# Altium schematic sheet bolid-inputs-lv.SchDoc
size A3
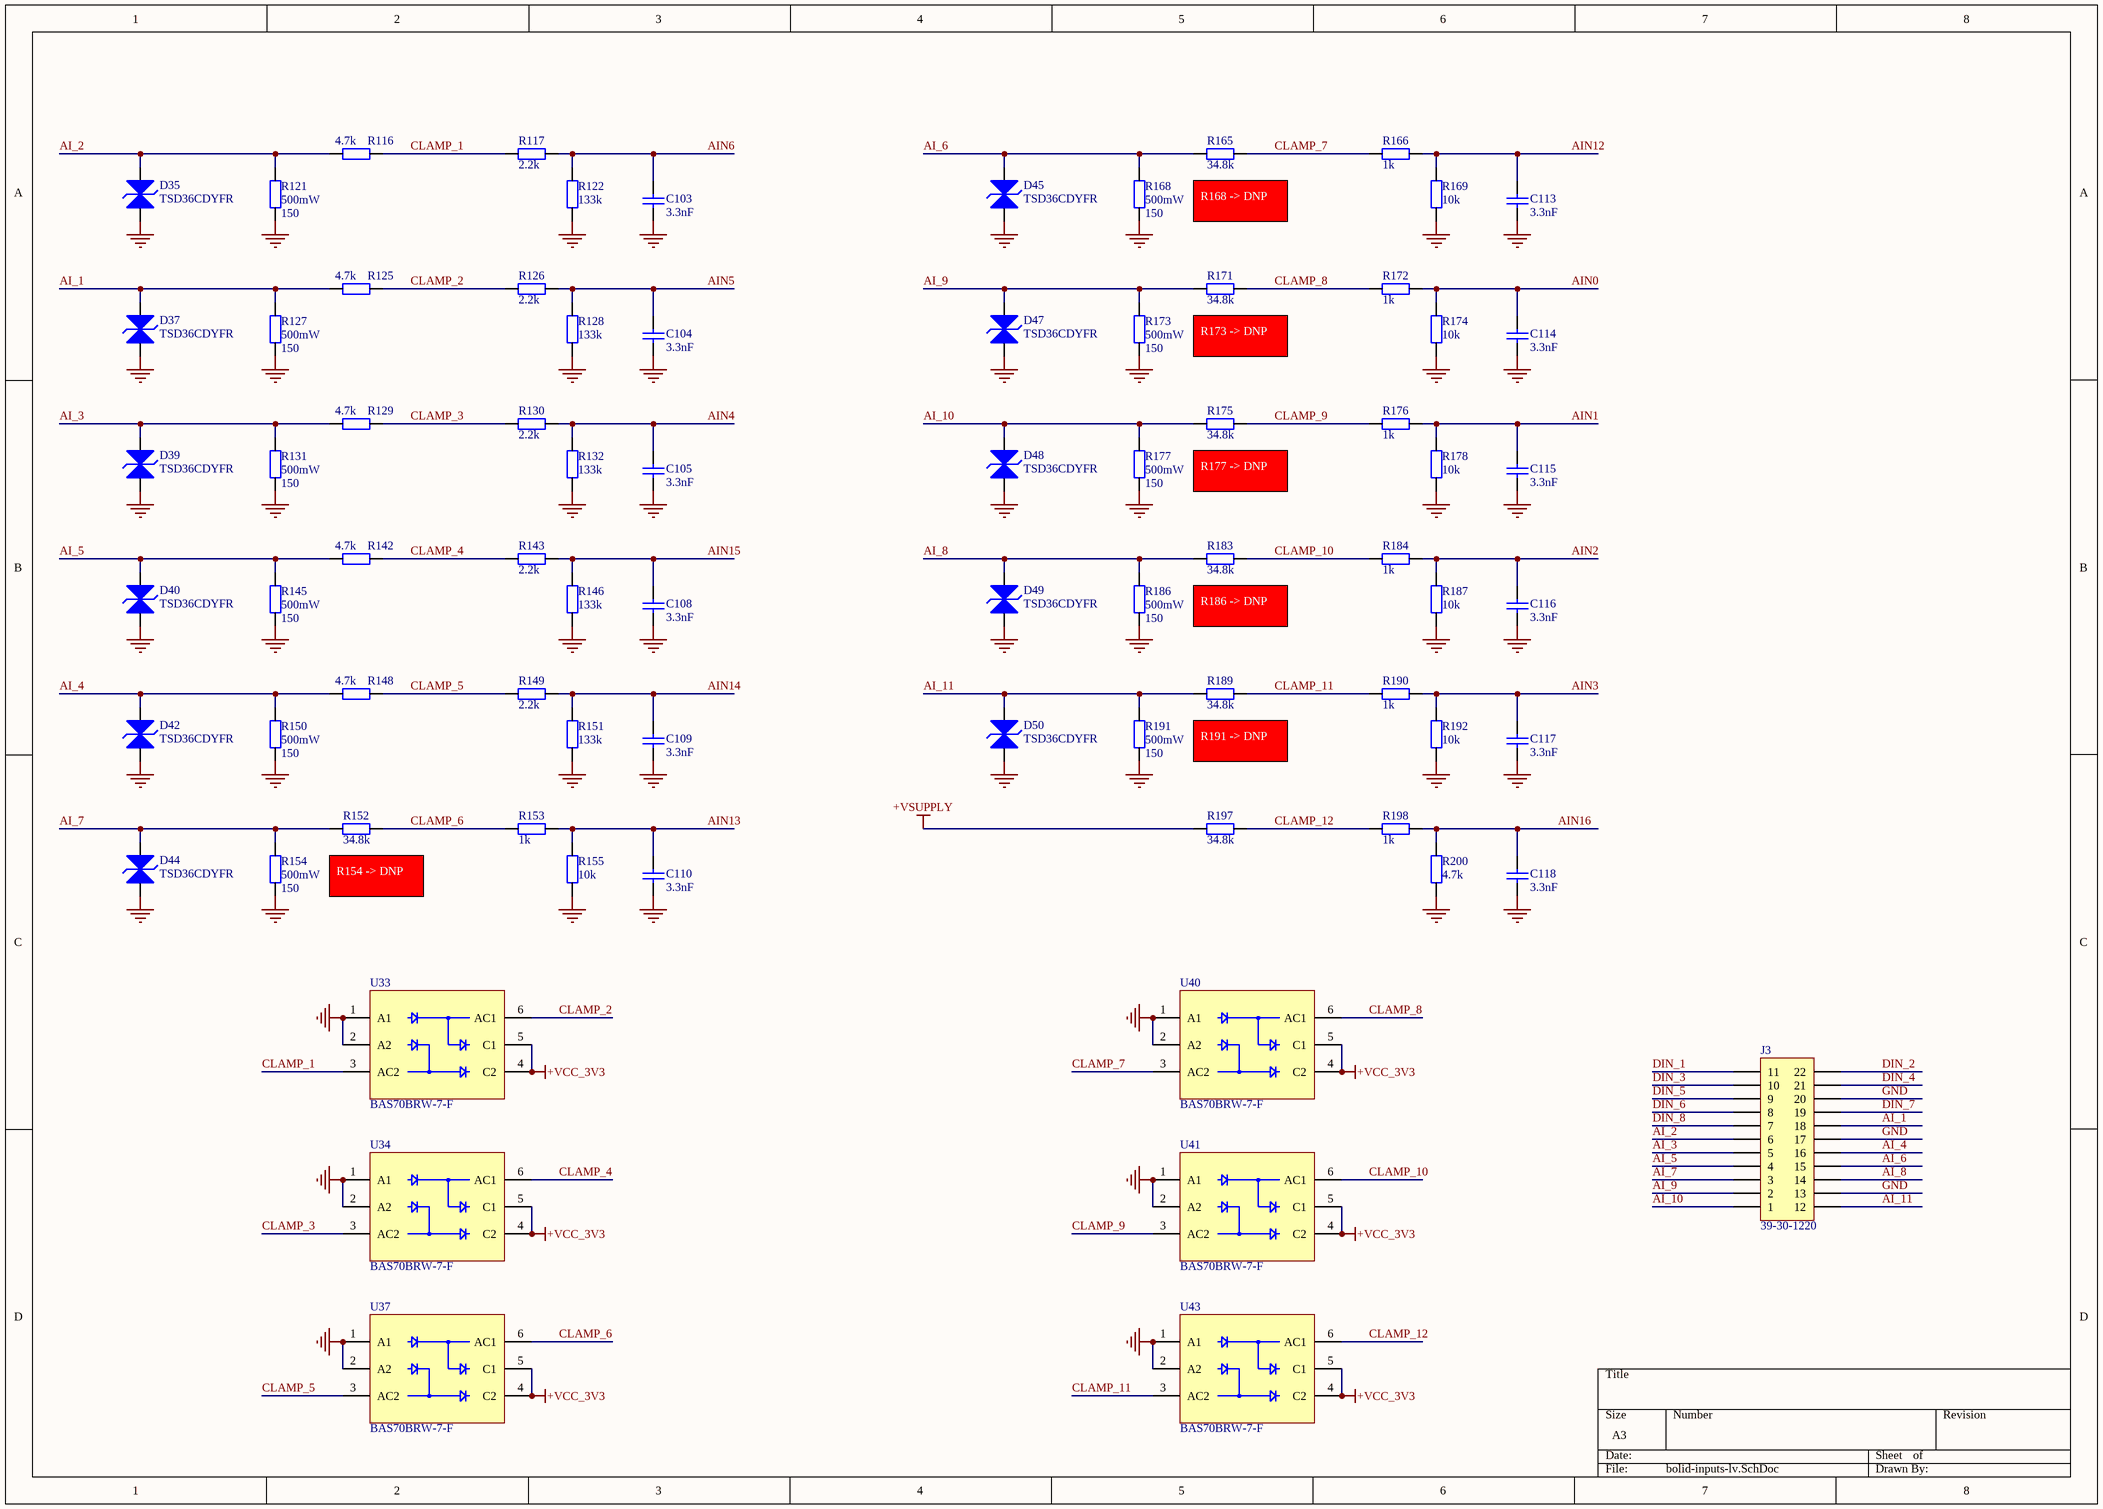
[diagram p0: bolid-inputs-lv.SchDoc]

## Parts
C103  Value Displayed: 3.3nF  [C0402-CAPC100X50X55L22 - Tayio Yuden TDK]  (hidden comment: GRM155R71H332JA01J)
C104  Value Displayed: 3.3nF  [C0402-CAPC100X50X55L22 - Tayio Yuden TDK]  (hidden comment: GRM155R71H332JA01J)
C105  Value Displayed: 3.3nF  [C0402-CAPC100X50X55L22 - Tayio Yuden TDK]  (hidden comment: GRM155R71H332JA01J)
C108  Value Displayed: 3.3nF  [C0402-CAPC100X50X55L22 - Tayio Yuden TDK]  (hidden comment: GRM155R71H332JA01J)
C109  Value Displayed: 3.3nF  [C0402-CAPC100X50X55L22 - Tayio Yuden TDK]  (hidden comment: GRM155R71H332JA01J)
C110  Value Displayed: 3.3nF  [C0402-CAPC100X50X55L22 - Tayio Yuden TDK]  (hidden comment: GRM155R71H332JA01J)
C113  Value Displayed: 3.3nF  [C0402-CAPC100X50X55L22 - Tayio Yuden TDK]  (hidden comment: GRM155R71H332JA01J)
C114  Value Displayed: 3.3nF  [C0402-CAPC100X50X55L22 - Tayio Yuden TDK]  (hidden comment: GRM155R71H332JA01J)
C115  Value Displayed: 3.3nF  [C0402-CAPC100X50X55L22 - Tayio Yuden TDK]  (hidden comment: GRM155R71H332JA01J)
C116  Value Displayed: 3.3nF  [C0402-CAPC100X50X55L22 - Tayio Yuden TDK]  (hidden comment: GRM155R71H332JA01J)
C117  Value Displayed: 3.3nF  [C0402-CAPC100X50X55L22 - Tayio Yuden TDK]  (hidden comment: GRM155R71H332JA01J)
C118  Value Displayed: 3.3nF  [C0402-CAPC100X50X55L22 - Tayio Yuden TDK]  (hidden comment: GRM155R71H332JA01J)
D35  TSD36CDYFR  [SOD-323 DYF0002A TI - BIDIRECTIONAL]
D37  TSD36CDYFR  [SOD-323 DYF0002A TI - BIDIRECTIONAL]
D39  TSD36CDYFR  [SOD-323 DYF0002A TI - BIDIRECTIONAL]
D40  TSD36CDYFR  [SOD-323 DYF0002A TI - BIDIRECTIONAL]
D42  TSD36CDYFR  [SOD-323 DYF0002A TI - BIDIRECTIONAL]
D44  TSD36CDYFR  [SOD-323 DYF0002A TI - BIDIRECTIONAL]
D45  TSD36CDYFR  [SOD-323 DYF0002A TI - BIDIRECTIONAL]
D47  TSD36CDYFR  [SOD-323 DYF0002A TI - BIDIRECTIONAL]
D48  TSD36CDYFR  [SOD-323 DYF0002A TI - BIDIRECTIONAL]
D49  TSD36CDYFR  [SOD-323 DYF0002A TI - BIDIRECTIONAL]
D50  TSD36CDYFR  [SOD-323 DYF0002A TI - BIDIRECTIONAL]
J3  39-30-1220  [MOLEX Mini-Fit Jr 039301220 2x11 Peg]
R116  value 4.7k  [R0402-RESC100X50X40L22N]  (hidden comment: RC0402FR-074K7L)
R117  value 2.2k  [R0402-RESC100X50X40L22N]  (hidden comment: RC0402FR-072K2L)
R121  value 150  Power Rating: 500mW  [R1210-RESC3126X06N - Yageo]  (hidden comment: RC1210FR-07150RL)
R122  value 133k  [R0402-RESC100X50X40L22N]  (hidden comment: RC0402FR-07133KL)
R125  value 4.7k  [R0402-RESC100X50X40L22N]  (hidden comment: RC0402FR-074K7L)
R126  value 2.2k  [R0402-RESC100X50X40L22N]  (hidden comment: RC0402FR-072K2L)
R127  value 150  Power Rating: 500mW  [R1210-RESC3126X06N - Yageo]  (hidden comment: RC1210FR-07150RL)
R128  value 133k  [R0402-RESC100X50X40L22N]  (hidden comment: RC0402FR-07133KL)
R129  value 4.7k  [R0402-RESC100X50X40L22N]  (hidden comment: RC0402FR-074K7L)
R130  value 2.2k  [R0402-RESC100X50X40L22N]  (hidden comment: RC0402FR-072K2L)
R131  value 150  Power Rating: 500mW  [R1210-RESC3126X06N - Yageo]  (hidden comment: RC1210FR-07150RL)
R132  value 133k  [R0402-RESC100X50X40L22N]  (hidden comment: RC0402FR-07133KL)
R142  value 4.7k  [R0402-RESC100X50X40L22N]  (hidden comment: RC0402FR-074K7L)
R143  value 2.2k  [R0402-RESC100X50X40L22N]  (hidden comment: RC0402FR-072K2L)
R145  value 150  Power Rating: 500mW  [R1210-RESC3126X06N - Yageo]  (hidden comment: RC1210FR-07150RL)
R146  value 133k  [R0402-RESC100X50X40L22N]  (hidden comment: RC0402FR-07133KL)
R148  value 4.7k  [R0402-RESC100X50X40L22N]  (hidden comment: RC0402FR-074K7L)
R149  value 2.2k  [R0402-RESC100X50X40L22N]  (hidden comment: RC0402FR-072K2L)
R150  value 150  Power Rating: 500mW  [R1210-RESC3126X06N - Yageo]  (hidden comment: RC1210FR-07150RL)
R151  value 133k  [R0402-RESC100X50X40L22N]  (hidden comment: RC0402FR-07133KL)
R152  value 34.8k  [R0402-RESC100X50X40L22N]  (hidden comment: RC0402FR-0734K8L)
R153  value 1k  [R0402-RESC100X50X40L22N]  (hidden comment: RC0402FR-071KL)
R154  value 150  Power Rating: 500mW  [R1210-RESC3126X06N - Yageo]  (hidden comment: RC1210FR-07150RL)
R155  value 10k  [R0402-RESC100X50X40L22N]  (hidden comment: RC0402FR-0710KL)
R165  value 34.8k  [R0402-RESC100X50X40L22N]  (hidden comment: RC0402FR-0734K8L)
R166  value 1k  [R0402-RESC100X50X40L22N]  (hidden comment: RC0402FR-071KL)
R168  value 150  Power Rating: 500mW  [R1210-RESC3126X06N - Yageo]  (hidden comment: RC1210FR-07150RL)
R169  value 10k  [R0402-RESC100X50X40L22N]  (hidden comment: RC0402FR-0710KL)
R171  value 34.8k  [R0402-RESC100X50X40L22N]  (hidden comment: RC0402FR-0734K8L)
R172  value 1k  [R0402-RESC100X50X40L22N]  (hidden comment: RC0402FR-071KL)
R173  value 150  Power Rating: 500mW  [R1210-RESC3126X06N - Yageo]  (hidden comment: RC1210FR-07150RL)
R174  value 10k  [R0402-RESC100X50X40L22N]  (hidden comment: RC0402FR-0710KL)
R175  value 34.8k  [R0402-RESC100X50X40L22N]  (hidden comment: RC0402FR-0734K8L)
R176  value 1k  [R0402-RESC100X50X40L22N]  (hidden comment: RC0402FR-071KL)
R177  value 150  Power Rating: 500mW  [R1210-RESC3126X06N - Yageo]  (hidden comment: RC1210FR-07150RL)
R178  value 10k  [R0402-RESC100X50X40L22N]  (hidden comment: RC0402FR-0710KL)
R183  value 34.8k  [R0402-RESC100X50X40L22N]  (hidden comment: RC0402FR-0734K8L)
R184  value 1k  [R0402-RESC100X50X40L22N]  (hidden comment: RC0402FR-071KL)
R186  value 150  Power Rating: 500mW  [R1210-RESC3126X06N - Yageo]  (hidden comment: RC1210FR-07150RL)
R187  value 10k  [R0402-RESC100X50X40L22N]  (hidden comment: RC0402FR-0710KL)
R189  value 34.8k  [R0402-RESC100X50X40L22N]  (hidden comment: RC0402FR-0734K8L)
R190  value 1k  [R0402-RESC100X50X40L22N]  (hidden comment: RC0402FR-071KL)
R191  value 150  Power Rating: 500mW  [R1210-RESC3126X06N - Yageo]  (hidden comment: RC1210FR-07150RL)
R192  value 10k  [R0402-RESC100X50X40L22N]  (hidden comment: RC0402FR-0710KL)
R197  value 34.8k  [R0402-RESC100X50X40L22N]  (hidden comment: RC0402FR-0734K8L)
R198  value 1k  [R0402-RESC100X50X40L22N]  (hidden comment: RC0402FR-071KL)
R200  value 4.7k  [R0402-RESC100X50X40L22N]  (hidden comment: RC0402FR-074K7L)
U33  BAS70BRW-7-F  [SOT363 DIODES DS30158 Rev. 14-2 SOT65P210X110-6N]
U34  BAS70BRW-7-F  [SOT363 DIODES DS30158 Rev. 14-2 SOT65P210X110-6N]
U37  BAS70BRW-7-F  [SOT363 DIODES DS30158 Rev. 14-2 SOT65P210X110-6N]
U40  BAS70BRW-7-F  [SOT363 DIODES DS30158 Rev. 14-2 SOT65P210X110-6N]
U41  BAS70BRW-7-F  [SOT363 DIODES DS30158 Rev. 14-2 SOT65P210X110-6N]
U43  BAS70BRW-7-F  [SOT363 DIODES DS30158 Rev. 14-2 SOT65P210X110-6N]

## Nets
+VCC_3V3: U33.4(C2) U33.5(C1) U34.4(C2) U34.5(C1) U37.4(C2) U37.5(C1) U40.4(C2) U40.5(C1) U41.4(C2) U41.5(C1) U43.4(C2) U43.5(C1)
+VSUPPLY: R197.1
GND: C103.1 C104.1 C105.1 C108.1 C109.1 C110.1 C113.1 C114.1 C115.1 C116.1 C117.1 C118.1 D35.1 D37.1 D39.1 D40.1 D42.1 D44.1 D45.1 D47.1 D48.1 D49.1 D50.1 J3.13 J3.17 J3.20 R121.1 R122.1 R127.1 R128.1 R131.1 R132.1 R145.1 R146.1 R150.1 R151.1 R154.1 R155.1 R168.1 R169.1 R173.1 R174.1 R177.1 R178.1 R186.1 R187.1 R191.1 R192.1 R200.1 U33.1(A1) U33.2(A2) U34.1(A1) U34.2(A2) U37.1(A1) U37.2(A2) U40.1(A1) U40.2(A2) U41.1(A1) U41.2(A2) U43.1(A1) U43.2(A2)
AI_1: D37.2 J3.18 R125.1 R127.2
AI_2: D35.2 J3.6 R116.1 R121.2
AI_3: D39.2 J3.5 R129.1 R131.2
AI_4: D42.2 J3.16 R148.1 R150.2
AI_5: D40.2 J3.4 R142.1 R145.2
AI_6: D45.2 J3.15 R165.1 R168.2
AI_7: D44.2 J3.3 R152.1 R154.2
AI_8: D49.2 J3.14 R183.1 R186.2
AI_9: D47.2 J3.2 R171.1 R173.2
AI_10: D48.2 J3.1 R175.1 R177.2
AI_11: D50.2 J3.12 R189.1 R191.2
AIN0: C114.2 R172.2 R174.2
AIN1: C115.2 R176.2 R178.2
AIN2: C116.2 R184.2 R187.2
AIN3: C117.2 R190.2 R192.2
AIN4: C105.2 R130.1 R132.2
AIN5: C104.2 R126.1 R128.2
AIN6: C103.2 R117.1 R122.2
AIN12: C113.2 R166.2 R169.2
AIN13: C110.2 R153.2 R155.2
AIN14: C109.2 R149.1 R151.2
AIN15: C108.2 R143.1 R146.2
AIN16: C118.2 R198.2 R200.2
CLAMP_1: R116.2 R117.2 U33.3(AC2)
CLAMP_2: R125.2 R126.2 U33.6(AC1)
CLAMP_3: R129.2 R130.2 U34.3(AC2)
CLAMP_4: R142.2 R143.2 U34.6(AC1)
CLAMP_5: R148.2 R149.2 U37.3(AC2)
CLAMP_6: R152.2 R153.1 U37.6(AC1)
CLAMP_7: R165.2 R166.1 U40.3(AC2)
CLAMP_8: R171.2 R172.1 U40.6(AC1)
CLAMP_9: R175.2 R176.1 U41.3(AC2)
CLAMP_10: R183.2 R184.1 U41.6(AC1)
CLAMP_11: R189.2 R190.1 U43.3(AC2)
CLAMP_12: R197.2 R198.1 U43.6(AC1)
DIN_1: J3.11
DIN_2: J3.22
DIN_3: J3.10
DIN_4: J3.21
DIN_5: J3.9
DIN_6: J3.8
DIN_7: J3.19
DIN_8: J3.7

## Notes on the sheet
- (near R165) R168 -> DNP
- (near R171) R173 -> DNP
- (near R175) R177 -> DNP
- (near R183) R186 -> DNP
- (near R189) R191 -> DNP
- (near R152) R154 -> DNP

## Library data of the parts
C103-C105 C108-C110 C113-C118 = GRM155R71H332JA01J: MLCC 0402 (1005) 3.3nF 5% 50V X7R; Manufacturer: Murata; Value: 3.3n; Supplier 1: Mouser; Manufacturer Part Number: GRM155R71H332JA01J; RoHS: Yes; Category: Ceramic Capacitors; Stock 1: 49279; Pricing 1: 1=0,1, 10=0,022, 50=0,022, 100=0,011, 1000=0,007, 10000=0,006 (USD); Case/Package: 343Case; Voltage Rating (DC): 50V; Dielectric: X7R; Tolerance: 5%; Capacitance: 3.3nF; Length: 1mm; Width: 500um; Thickness: 500um; RoHS Compliant: Yes; Supplier Part Number 1: 81-GRM155R71H332JA1J
D35 D37 D39 D40 D42 D44 D45 D47-D50 = TSD36CDYFR: 36V bidirectional surge protection diode in SOD323 package 2-SOT -55 to 150; Manufacturer: Texas Instruments; Supplier 1: Mouser; Manufacturer Part Number: TSD36CDYFR; RoHS: No; Stock 1: 6000; Pricing 1: 1=0,4, 10=0,29, 50=0,29, 100=0,146, 1000=0,1, 10000=0,078 (USD); Case/Package: SOT; Number of Pins: 2; Length: 1.3mm; Width: 1.7mm; Thickness: 850um; Supplier Part Number 1: 595-TSD36CDYFR
J3 = 039301220: Molex MiniFit Jr 2x11 Peg Conn Power HDR 22 POS 4.2mm Solder RA Thru-Hole 22 Terminal 1 Port Bag; Supplier 1: Mouser; Manufacturer: Molex; Manufacturer Part Number: 39-30-1220; RoHS: Yes; Category: Headers and Wire Housings; Stock 1: 554; Pricing 1: 1=3,28, 10=2,69, 50=2,69, 100=2,29, 1000=2,16, 10000=2,15 (USD); ComponentLink1URL: https://datasheet.ciiva.com/5149/0039301220-pcb-headers-160144-5149966.pdf?src-supplier=Mouser; ComponentLink1Description: https://datasheet.ciiva.com/5149/0039301220-pcb-headers-160144-5149966.pdf?src-supplier=Mouser; ComponentLink2URL: https://datasheet.ciiva.com/11750/0900766b805f2c40-11750460.pdf?src-supplier=Rs; ComponentLink2Description: https://datasheet.ciiva.com/11750/0900766b805f2c40-11750460.pdf?src-supplier=Rs; ComponentLink3URL: https://datasheet.ciiva.com/1443/1775068-1443200.pdf?src-supplier=Element14; ComponentLink3Description: https://datasheet.ciiva.com/1443/1775068-1443200.pdf?src-supplier=Element14; ComponentLink4URL: https://datasheet.ciiva.com/30171/97700039301220-pcb-headers-30171274.pdf?src-supplier=Onlinecomponents.com; ComponentLink4Description: https://datasheet.ciiva.com/30171/97700039301220-pcb-headers-30171274.pdf?src-supplier=Onlinecomponents.com; ComponentLink5URL: https://datasheet.ciiva.com/49273/304186-49273820.pdf?src-supplier=Jameco; ComponentLink5Description: https://datasheet.ciiva.com/49273/304186-49273820.pdf?src-supplier=Jameco; ComponentLink6URL: https://datasheet.ciiva.com/1451/1775068-1451585.pdf?src-supplier=Farnell; ComponentLink6Description: https://datasheet.ciiva.com/1451/1775068-1451585.pdf?src-supplier=Farnell; Supplier Part Number 1: 538-39-30-1220
R116 R125 R129 R142 R148 R200 = RC0402FR-074K7L: RES 0402 (1005) 4.70k 1% 0.063W 50V Thick Film; Manufacturer: Yageo; Power Rating: 62.5 mW (1/16 W); Resistance: 4.7 kOhms; Temperature Coefficient: 100 PPM / C; Supplier 1: Mouser; Manufacturer Part Number: RC0402FR-074K7L; RoHS: RoHS Compliant By Exemption; Category: Thick Film Resistors - SMD; Stock 1: 1586127; Pricing 1: 1=0.090, 10=0.011, 100=0.004, 1000=0.003, 10000=0.003 (EUR); Application: High Reliability; Features: -; Height: 0.35 mm; Length: 1 mm; Package / Case: -; Packaging: Cut Tape; Product: Thick Film Resistors SMD; Series: RC; Technology: Thick Film; Termination Style: SMD/SMT; Tolerance: 1 %; Type: General Purpose; Voltage Rating: 50 V; Width: 0.5 mm; Brand: Yageo; Mounting Style: PCB Mount; Case Code - in: 0402; Case Code - mm: 1005; Maximum Operating Temperature: + 155 C; Minimum Operating Temperature: - 55 C; Product Type: Thick Film Resistors; Standard Pack Qty: 10000; Subcategory: Resistors; RoHS - Mouser: E; Minimum Order Quantity: 1; Reeling: True; ComponentLink1URL: https://www.mouser.com/datasheet/2/447/PYu-RC_Group_51_RoHS_L_10-1664068.pdf; ComponentLink1Description: https://www.mouser.com/datasheet/2/447/PYu-RC_Group_51_RoHS_L_10-1664068.pdf; Supplier Part Number 1: 603-RC0402FR-074K7L
R117 R126 R130 R143 R149 = RC0402FR-072K2L: RES 0402 (1005) 2.20k 1% 0.0625W 50V Thick Film; Manufacturer: Yageo; Power Rating: 62.5 mW, 125 mW; Resistance: 2.2 kOhms; Temperature Coefficient: 100 PPM / C; Supplier 1: Mouser; Manufacturer Part Number: RC0402FR-072K2L; RoHS: RoHS Compliant By Exemption; Category: Thick Film Resistors - SMD; Stock 1: 1394386; Pricing 1: 1=0.090, 10=0.011, 100=0.004, 1000=0.003, 10000=0.003 (EUR); Application: High Reliability; Features: -; Height: 0.35 mm; Length: 1 mm; Package / Case: -; Packaging: Cut Tape; Product: Thick Film Resistors SMD; Series: RC; Technology: Thick Film; Termination Style: SMD/SMT; Tolerance: 1 %; Type: General Purpose; Voltage Rating: 50 V; Width: 0.5 mm; Brand: Yageo; Mounting Style: PCB Mount; Case Code - in: 0402; Case Code - mm: 1005; Maximum Operating Temperature: + 155 C; Minimum Operating Temperature: - 55 C; Product Type: Thick Film Resistors; Standard Pack Qty: 10000; Subcategory: Resistors; RoHS - Mouser: E; Minimum Order Quantity: 1; Reeling: True; ComponentLink1URL: https://www.mouser.com/datasheet/2/447/PYu-RC_Group_51_RoHS_L_10-1664068.pdf; ComponentLink1Description: https://www.mouser.com/datasheet/2/447/PYu-RC_Group_51_RoHS_L_10-1664068.pdf; Supplier Part Number 1: 603-RC0402FR-072K2L
R121 R127 R131 R145 R150 R154 R168 R173 R177 R186 R191 = RC1210FR-07150RL: RES 1210 (3225) 150.0R 1% 0.500W 200V Thick Film; Manufacturer: Yageo; Resistance: 150R; Temperature Coefficient: 100ppm/°C; Supplier 1: Mouser; Manufacturer Part Number: RC1210FR-07150RL; RoHS: Yes; Category: Chip SMD Resistors; Stock 1: 69300; Pricing 1: 1=0,12, 10=0,035, 50=0,035, 100=0,022, 1000=0,015, 10000=0,014 (USD); Mount: Surface Mount; Case/Package: 1210; Case Code (Imperial): 1210; Case Code (Metric): 3225; Contact Plating: Tin,Matte; Min Operating Temperature: -55°C; Max Operating Temperature: 155°C; Packaging: Tape and Reel; Tolerance: 1%; Voltage Rating: 200V; Termination: SMD/SMT; Number of Terminations: 2; Max Power Dissipation: 500mW; Features: Moisture Resistant; Series: RC; Technology: THICK FILM; Length: 3.1mm; Width: 2.6mm; Height: 0.5mm; Depth: 2.6mm; RoHS Compliant: Yes; ComponentLink1URL: https://datasheet.ciiva.com/11809/0900766b8079c86c-11809577.pdf?src-supplier=Rs; ComponentLink1Description: https://datasheet.ciiva.com/11809/0900766b8079c86c-11809577.pdf?src-supplier=Rs; ComponentLink2URL: https://datasheet.ciiva.com/8887/pyu-rc1210-51-rohs-l-4-8887352.pdf?src-supplier=Avnet; ComponentLink2Description: https://datasheet.ciiva.com/8887/pyu-rc1210-51-rohs-l-4-8887352.pdf?src-supplier=Avnet; Supplier Part Number 1: 603-RC1210FR-07150RL
R122 R128 R132 R146 R151 = RC0402FR-07133KL: RES 0402 (1005) 133.0k 1% 0.0625W 50V Thick Film; Manufacturer: Yageo; Resistance: 133kR; Power Rating: 62.5mW; Temperature Coefficient: 100ppm/°C; Max Power Dissipation: 63mW; Supplier 1: Mouser; Manufacturer Part Number: RC0402FR-07133KL; RoHS: Yes; Category: Chip SMD Resistors; Stock 1: 76079; Pricing 1: 1=0,10000, 10=0,01200, 50=0,01200, 100=0,00500, 1000=0,00300, 2500=0,00200, 10000=0,00100 (USD); Case/Package: 0402; Case Code (Imperial): 0402; Case Code (Metric): 1005; Weight: 2.3E-05oz; Contact Plating: Tin,Matte; Min Operating Temperature: -55°C; Max Operating Temperature: 155°C; Tolerance: 1%; Voltage Rating: 50V; Packaging: Tape and Reel; Resistor Type: Thick Film; Termination: SMD/SMT; Number of Terminations: 2; Voltage Rating (DC): 50V; Working Voltage: 50V; Features: Moisture Resistant; Series: RC; Construction: Rectangular; Technology: THICK FILM; Length: 1mm; Width: 0.5mm; Height: 0.016inch; Depth: 0.5mm; Military Standard: Not; Lead Free: Lead Free; RoHS Compliant: Yes; ComponentLink1URL: https://datasheet.ciiva.com/8887/pyu-rc0402-51-rohs-l-6-8887454.pdf?src-supplier=Avnet; ComponentLink1Description: https://datasheet.ciiva.com/8887/pyu-rc0402-51-rohs-l-6-8887454.pdf?src-supplier=Avnet; ComponentLink2URL: https://datasheet.ciiva.com/16742/pyu-rc0402-51-rohs-l-6-r-16742778.pdf?src-supplier=Future+Electronics; ComponentLink2Description: https://datasheet.ciiva.com/16742/pyu-rc0402-51-rohs-l-6-r-16742778.pdf?src-supplier=Future+Electronics; Supplier Part Number 1: 603-RC0402FR-07133KL
R152 R165 R171 R175 R183 R189 R197 = RC0402FR-0734K8L: RES 0402 (1005) 34.8k 1% 0.0625W 50V Thick Film; Manufacturer: Yageo; Power Rating: 62.5 mW (1/16 W); Resistance: 34.8 kOhms; Temperature Coefficient: 100 PPM / C; Supplier 1: Mouser; Manufacturer Part Number: RC0402FR-0734K8L; RoHS: RoHS Compliant By Exemption; Category: Thick Film Resistors - SMD; Stock 1: 26065; Pricing 1: 1=0.085, 10=0.010, 100=0.003, 10000=0.003 (EUR); Application: High Reliability; Features: -; Height: 0.35 mm; Length: 1 mm; Package / Case: -; Packaging: Cut Tape; Product: Thick Film Resistors SMD; Series: RC; Technology: Thick Film; Termination Style: SMD/SMT; Tolerance: 1 %; Type: General Purpose; Voltage Rating: 50 V; Width: 0.5 mm; Brand: Yageo; Mounting Style: PCB Mount; Case Code - in: 0402; Case Code - mm: 1005; Maximum Operating Temperature: + 155 C; Minimum Operating Temperature: - 55 C; Product Type: Thick Film Resistors; Standard Pack Qty: 10000; Subcategory: Resistors; RoHS - Mouser: E; Minimum Order Quantity: 1; Reeling: True; ComponentLink1URL: https://www.mouser.com/datasheet/2/447/PYu_RC_Group_51_RoHS_L_10-1664068.pdf; ComponentLink1Description: https://www.mouser.com/datasheet/2/447/PYu_RC_Group_51_RoHS_L_10-1664068.pdf; Supplier Part Number 1: 603-RC0402FR-0734K8L
R153 R166 R172 R176 R184 R190 R198 = RC0402FR-071KL: RES 0402 (1005) 1.00k 1% 0.0625W 50V Thick Film; Manufacturer: Yageo; Power Rating: 62.5 mW, 125 mW; Resistance: 1 kOhms; Temperature Coefficient: 100 PPM / C; Supplier 1: Mouser; Manufacturer Part Number: RC0402FR-071KL; RoHS: RoHS Compliant; Category: Thick Film Resistors - SMD; Stock 1: 18776448; Pricing 1: 1=0.090, 10=0.011, 100=0.004, 1000=0.003, 10000=0.003 (EUR); Application: High Reliability; Features: -; Height: 0.35 mm; Length: 1 mm; Package / Case: -; Packaging: Cut Tape; Product: Thick Film Resistors SMD; Series: RC; Technology: Thick Film; Termination Style: SMD/SMT; Tolerance: 1 %; Type: General Purpose; Voltage Rating: 50 V; Width: 0.5 mm; Brand: Yageo; Mounting Style: PCB Mount; Case Code - in: 0402; Case Code - mm: 1005; Maximum Operating Temperature: + 155 C; Minimum Operating Temperature: - 55 C; Product Type: Thick Film Resistors; Standard Pack Qty: 10000; Subcategory: Resistors; RoHS - Mouser: Y; Minimum Order Quantity: 1; Reeling: True; ComponentLink1URL: https://www.mouser.com/datasheet/2/447/PYu-RC_Group_51_RoHS_L_10-1664068.pdf; ComponentLink1Description: https://www.mouser.com/datasheet/2/447/PYu-RC_Group_51_RoHS_L_10-1664068.pdf; Supplier Part Number 1: 603-RC0402FR-071KL
R155 R169 R174 R178 R187 R192 = RC0402FR-0710KL: RES 0402 (1005) 10.0k 1% 0.0625W 50V Thick Film; Manufacturer: Yageo; Power Rating: 62.5 mW, 125 mW; Resistance: 10 kOhms; Temperature Coefficient: 100 PPM / C; Supplier 1: Mouser; Manufacturer Part Number: RC0402FR-0710KL; RoHS: RoHS Compliant; Category: Thick Film Resistors - SMD; Stock 1: 20942447; Pricing 1: 1=0.090, 10=0.011, 100=0.004, 1000=0.003, 10000=0.003 (EUR); Application: High Reliability; Features: -; Height: 0.35 mm; Length: 1 mm; Package / Case: -; Packaging: Cut Tape; Product: Thick Film Resistors SMD; Series: RC; Technology: Thick Film; Termination Style: SMD/SMT; Tolerance: 1 %; Type: General Purpose; Voltage Rating: 50 V; Width: 0.5 mm; Brand: Yageo; Mounting Style: PCB Mount; Case Code - in: 0402; Case Code - mm: 1005; Maximum Operating Temperature: + 155 C; Minimum Operating Temperature: - 55 C; Product Type: Thick Film Resistors; Standard Pack Qty: 10000; Subcategory: Resistors; RoHS - Mouser: Y; Minimum Order Quantity: 1; Reeling: True; ComponentLink1URL: https://www.mouser.com/datasheet/2/447/PYu-RC_Group_51_RoHS_L_10-1664068.pdf; ComponentLink1Description: https://www.mouser.com/datasheet/2/447/PYu-RC_Group_51_RoHS_L_10-1664068.pdf; Supplier Part Number 1: 603-RC0402FR-0710KL
U33 U34 U37 U40 U41 U43 = BAS70BRW-7-F: BAS70BRW Series 70 V 100 mA Surface Mount Schottky Barrier Diode Arrays SOT-363; Manufacturer: Diodes; Forward Current: 70mA; Max Reverse Current: 100nA; Forward Voltage: 1V; Max Power Dissipation: 200mW; Reverse Recovery Time: 5ns; Max Repetitive Reverse Voltage (Vrrm): 70V; Peak Non-Repetitive Surge Current: 100mA; Capacitance: 2pF; Supplier 1: Mouser; Manufacturer Part Number: BAS70BRW-7-F; RoHS: Yes; Category: Schottky Diodes; Stock 1: 23365; Pricing 1: 1=0,62000, 10=0,53000, 50=0,53000, 100=0,39600, 1000=0,24100, 10000=0,19700 (USD); Mount: Surface Mount; Case/Package: SOT-363; Number of Pins: 6; Weight: 0.000212oz; Contact Plating: Tin,Matte; Min Operating Temperature: -55°C; Max Operating Temperature: 125°C; Package Quantity: 3000; Packaging: Tape and Reel; Average Rectified Current: 70mA; Power Dissipation: 200mW; Termination: SMD/SMT; Max Forward Surge Current (Ifsm): 100mA; Current Rating: 70mA; Power Rating: 200mW; Voltage Rating (DC): 70V; Max Reverse Voltage (DC): 70V; Series: -; Length: 2.2mm; Width: 1.35mm; Height: 1mm; Radiation Hardening: No; Lead Free: Lead Free; RoHS Compliant: Yes; ComponentLink1URL: https://datasheet.ciiva.com/26949/getdatasheetpartid-202320-26949402.pdf?src-supplier=Verical; ComponentLink1Description: https://datasheet.ciiva.com/26949/getdatasheetpartid-202320-26949402.pdf?src-supplier=Verical; Supplier Part Number 1: 621-BAS70BRW-7-F